# Altium schematic sheet CON_ETHERNET_RJ45_LEDS.SchDoc: Ethernet Connector
size A4; DocumentNumber: 23; SheetNumber: 24; SheetTotal: 77
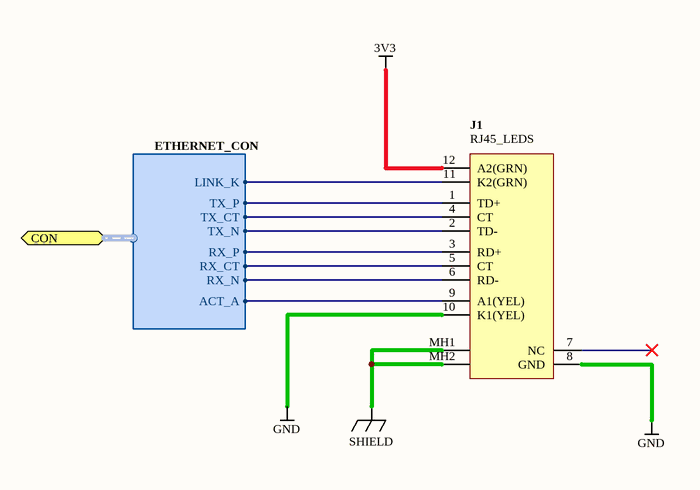
[diagram p0: CON_ETHERNET_RJ45_LEDS.SchDoc]

## Parts
J1  RJ45_LEDS  [CON_RJ45_RA_LEDS]

## Ports
CON (harness ETHERNET_CON)

## Harnesses
ETHERNET_CON: TX_P, TX_N, RX_P, RX_N, RX_CT, TX_CT, LINK_K, ACT_A

## Nets
3V3: J1.12(A2(GRN))
GND: J1.8(GND) J1.10(K1(YEL))
SHIELD: J1.MH1 J1.MH2
NetJ1_1: J1.1(TD+) ; port CON.TX_P
NetJ1_2: J1.2(TD-) ; port CON.TX_N
NetJ1_3: J1.3(RD+) ; port CON.RX_P
NetJ1_4: J1.4(CT) ; port CON.TX_CT
NetJ1_5: J1.5(CT) ; port CON.RX_CT
NetJ1_6: J1.6(RD-) ; port CON.RX_N
NetJ1_9: J1.9(A1(YEL)) ; port CON.ACT_A
NetJ1_11: J1.11(K2(GRN)) ; port CON.LINK_K

Not connected (* = marked no-connect by the designer): J1 7(NC)*

## Notes on the sheet
- Sheet Title
- Project Title
- Size:
- Date:
- A4
- Assy:
- Time:
- Revision:
- Sheet
- of
- File:

## Library data of the parts
J1 = D-300-0119: Socket, 1x1 Tab-DOWN R/A 8-Way RJ45; Connector type: Right Angle; Max Current: mA; Mounting Technology: Through-Hole; Status: Unreleased; Category: Connector